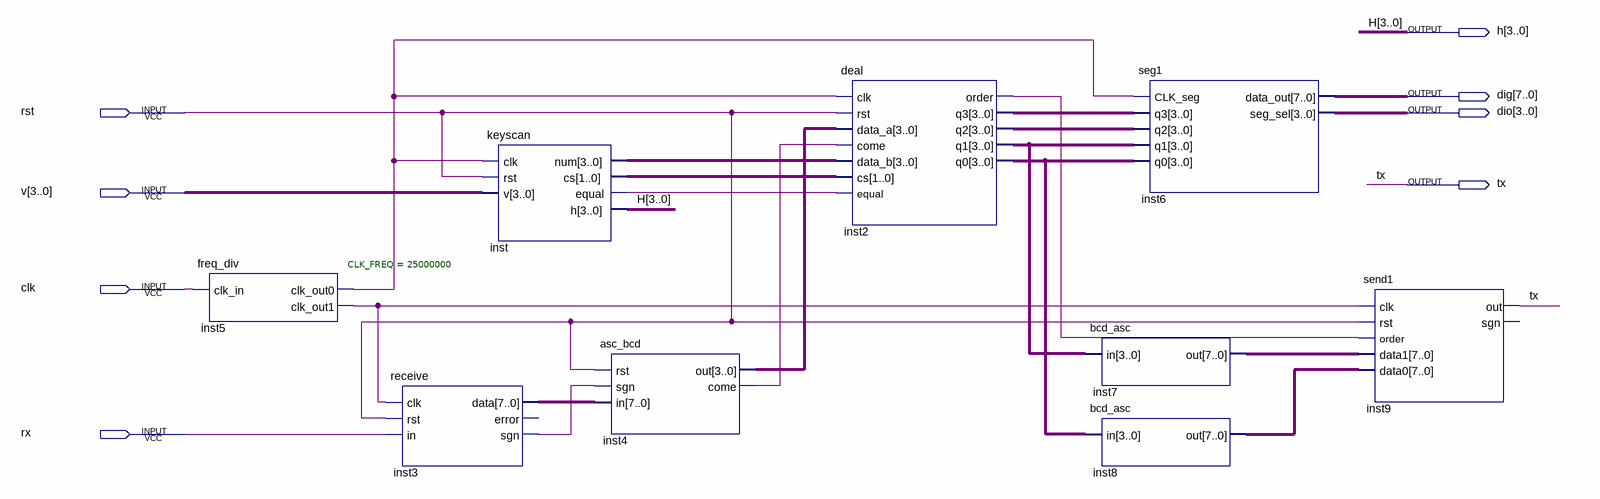
[diagram p0: schematic sheet]
// Quartus schematic calculator.bdf as structural Verilog: 9 symbols, 8 pins
module calculator (
  input  rst,
  input  [3:0] v,
  input  clk,
  input  rx,
  output [3:0] h,
  output [7:0] dig,
  output [3:0] dio,
  output tx
);

  wire inst2_order, inst3_sgn, inst4_come, inst5_clk_out0, inst5_clk_out1, inst_equal;
  wire [1:0] inst_cs;
  wire [3:0] inst2_q0, inst2_q1, inst2_q2, inst2_q3, inst4_out, inst_num;
  wire [7:0] inst3_data, inst7_out, inst8_out;

  freq_div #(.CLK_FREQ(25000000)) inst5 (.clk_in(clk), .clk_out0(inst5_clk_out0), .clk_out1(inst5_clk_out1));
  receive inst3 (.clk(inst5_clk_out1), .rst(rst), .in(rx), .data(inst3_data), .sgn(inst3_sgn));  // open: error
  keyscan inst (.clk(inst5_clk_out0), .rst(rst), .v(v), .num(inst_num), .cs(inst_cs), .equal(inst_equal), .h(h));
  asc_bcd inst4 (.rst(rst), .sgn(inst3_sgn), .in(inst3_data), .out(inst4_out), .come(inst4_come));
  deal inst2 (
    .clk(inst5_clk_out0), .rst(rst), .data_a(inst4_out), .come(inst4_come), .data_b(inst_num), .cs(inst_cs),
    .equal(inst_equal), .order(inst2_order), .q3(inst2_q3), .q2(inst2_q2), .q1(inst2_q1), .q0(inst2_q0));
  seg1 inst6 (
    .CLK_seg(inst5_clk_out0), .q3(inst2_q3), .q2(inst2_q2), .q1(inst2_q1), .q0(inst2_q0), .data_out(dig),
    .seg_sel(dio));
  bcd_asc inst7 (.in(inst2_q1), .out(inst7_out));
  bcd_asc inst8 (.in(inst2_q0), .out(inst8_out));
  send1 inst9 (
    .clk(inst5_clk_out1), .rst(rst), .order(inst2_order), .data1(inst7_out), .data0(inst8_out), .out(tx));  // open: sgn
endmodule
